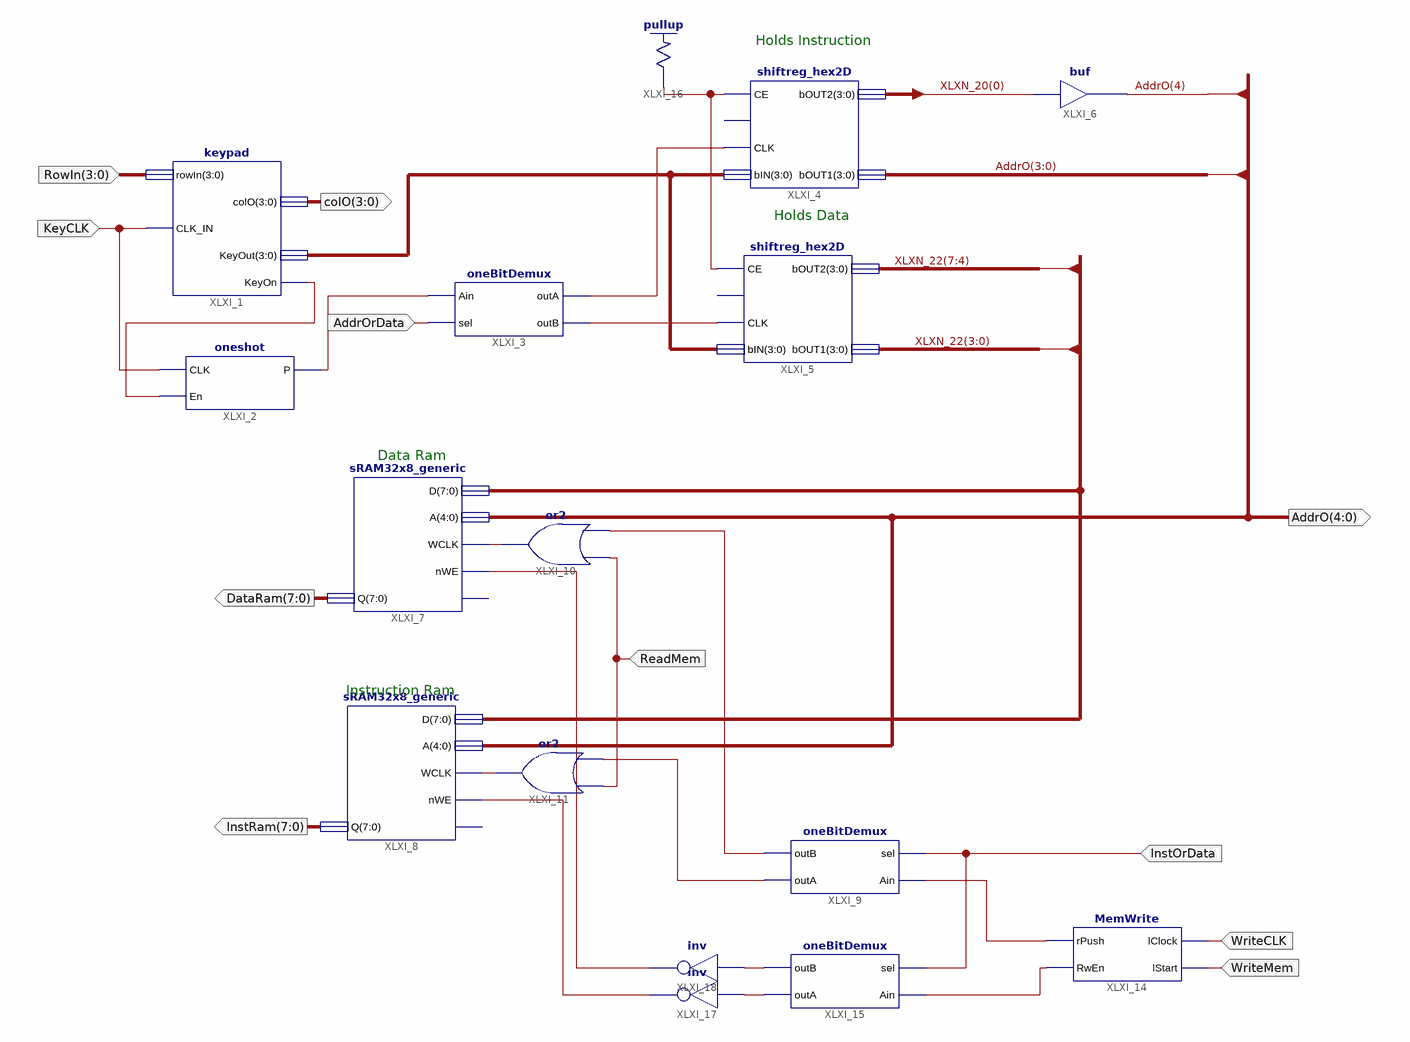
[diagram p0: schematic sheet 1]
// Xilinx ISE schematic KeyAndMemory.sch (spartan3e) as structural Verilog: 16 symbols, 11 ports
module KeyAndMemory (
  input  [3:0] RowIn,
  input  KeyCLK,
  input  AddrOrData,
  input  InstOrData,
  input  ReadMem,
  input  WriteMem,
  input  WriteCLK,
  output [3:0] colO,
  output [4:0] AddrO,
  output [7:0] DataRam,
  output [7:0] InstRam
);

  wire XLXN_4, XLXN_6, XLXN_8, XLXN_24, XLXN_25, XLXN_26, XLXN_27, XLXN_39, XLXN_42, XLXN_43, XLXN_44,
       XLXN_45, XLXN_46, XLXN_47, XLXN_48;
  wire [3:0] XLXN_9, XLXN_20;
  wire [7:0] XLXN_22;

  keypad XLXI_1 (.rowIn(RowIn), .CLK_IN(KeyCLK), .colO(colO), .KeyOut(XLXN_9), .KeyOn(XLXN_4));
  oneshot XLXI_2 (.CLK(KeyCLK), .En(XLXN_4), .P(XLXN_6));
  oneBitDemux XLXI_3 (.Ain(XLXN_6), .sel(AddrOrData), .outA(XLXN_42), .outB(XLXN_8));
  shiftreg_hex2D XLXI_4 (.CE(XLXN_43), .CLK(XLXN_42), .bIN(XLXN_9), .bOUT2(XLXN_20), .bOUT1(AddrO[3:0]));  // open: RST
  shiftreg_hex2D XLXI_5 (
    .CE(XLXN_43), .CLK(XLXN_8), .bIN(XLXN_9), .bOUT2(XLXN_22[7:4]), .bOUT1(XLXN_22[3:0]));  // open: RST
  buf XLXI_6 (AddrO[4], XLXN_20[0]);
  sRAM32x8_generic XLXI_7 (.nWE(XLXN_47), .WCLK(XLXN_24), .A(AddrO), .D(XLXN_22), .Q(DataRam));  // open: nCS
  sRAM32x8_generic XLXI_8 (.nWE(XLXN_46), .WCLK(XLXN_25), .A(AddrO), .D(XLXN_22), .Q(InstRam));  // open: nCS
  oneBitDemux XLXI_9 (.Ain(XLXN_48), .sel(InstOrData), .outA(XLXN_27), .outB(XLXN_26));
  or XLXI_10 (XLXN_24, XLXN_26, ReadMem);
  or XLXI_11 (XLXN_25, XLXN_27, ReadMem);
  MemWrite XLXI_14 (.lStart(WriteMem), .lClock(WriteCLK), .RwEn(XLXN_39), .rPush(XLXN_48));
  oneBitDemux XLXI_15 (.Ain(XLXN_39), .sel(InstOrData), .outA(XLXN_45), .outB(XLXN_44));
  \pullup  XLXI_16 (.O(XLXN_43));
  not XLXI_17 (XLXN_46, XLXN_45);
  not XLXI_18 (XLXN_47, XLXN_44);

  // Notes on the sheet:
  //   Holds Instruction
  //   Holds Data
  //   Data Ram
  //   Instruction Ram
endmodule
